# EAGLE design E6_funk (EAGLE 5.07)
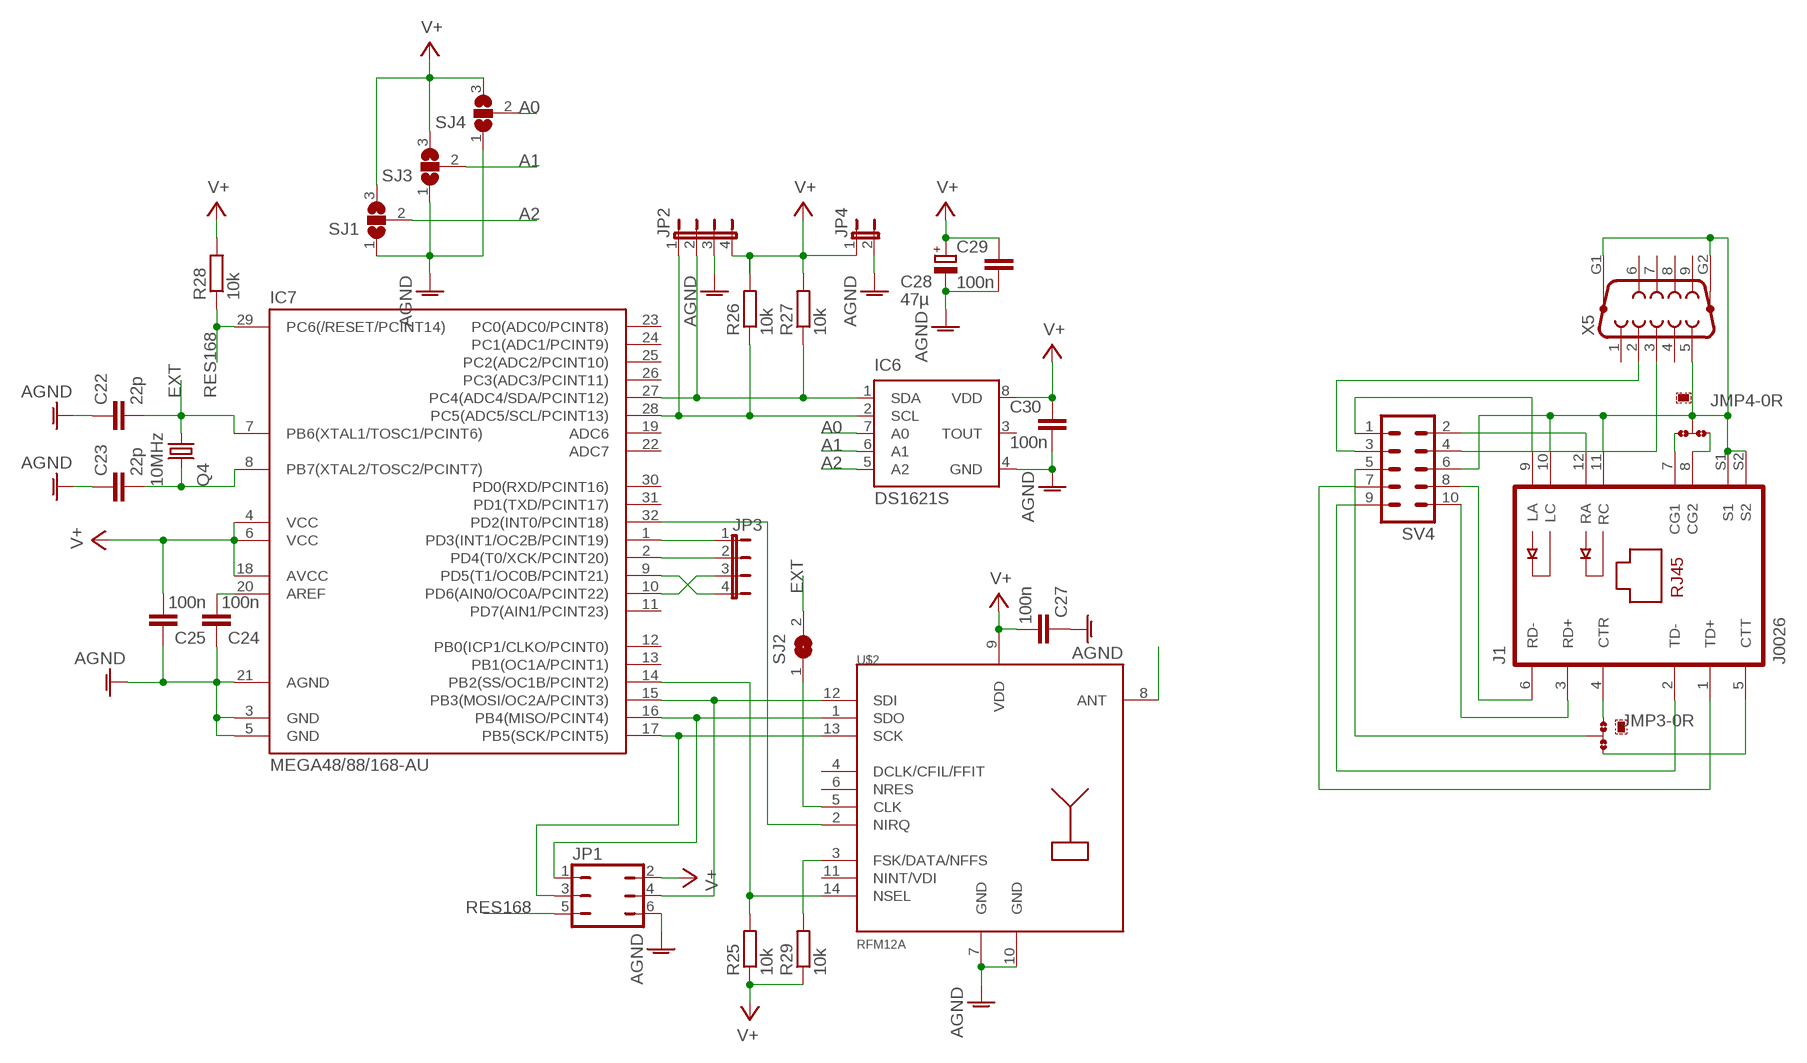
[diagram p0: schematic, sheet 1]

## Parts
C22  22p  C-EUC0805K  [C0805K]
C23  22p  C-EUC0805K  [C0805K]
C24  100n  C-EUC0805K  [C0805K]
C25  100n  C-EUC0805K  [C0805K]
C27  100n  C-EUC0805K  [C0805K]
C28  47µ  CPOL-EUSMCD  [SMC_D]
C29  100n  C-EUC0805K  [C0805K]
C30  100n  C-EUC0805K  [C0805K]
IC6  DS1621S  [SO08]
IC7  MEGA48/88/168-AU  [TQFP32-08]
J1  J0026  [SEGOR]
JMP3  0R-JUMPA  [A0R-JMP]
JMP4  0R-JUMPA  [A0R-JMP]
JP1  JP3Q  [JP3Q]
JP2  JP4E  [JP4]
JP3  JP4E  [JP4]
JP4  JP1E  [JP1]
Q4  10MHz  CRYSTALCTS406  [CTS406]
R25  10k  R-EU_R0805  [R0805]
R26  10k  R-EU_R0805  [R0805]
R27  10k  R-EU_R0805  [R0805]
R28  10k  R-EU_R0805  [R0805]
R29  10k  R-EU_R0805  [R0805]
SJ1  SJ2W  [SJ_2]
SJ2  SJ  [SJ]
SJ3  SJ2W  [SJ_2]
SJ4  SJ2W  [SJ_2]
SV4  ML10  [ML10]
U$2  RFM12A  [RFM1]
X5  F09HP  [F09HP]

## Nets
A0: IC6.7(A0) SJ4.2
A1: IC6.6(A1) SJ3.2
A2: IC6.5(A2) SJ1.2
AGND: C22.1 C23.2 C24.1 C25.1 C27.1 C28.- C29.2 C30.2 IC6.4(GND) IC7.3(GND) IC7.5(GND) IC7.21(AGND) JP1.6 JP2.3 JP4.2 SJ1.1 SJ3.1 SJ4.1 U$2.7(GND) U$2.10(GND)
EXT: C22.2 IC7.7(PB6(XTAL1/TOSC1/PCINT6)) Q4.1 SJ2.2
MASSE: J1.10(LC) J1.11(RC) J1.S1 J1.S2 JMP4.2 SV4.6 X5.5 X5.G1 X5.G2
N$39: J1.7(CG1) JMP4.1
N$40: J1.12(RA) SV4.2
N$41: J1.9(LA) SV4.1
N$42: J1.2(TD-) SV4.9
N$43: J1.1(TD+) SV4.7
N$49: IC7.10(PD6(AIN0/OC0A/PCINT22)) JP3.3
N$56: C23.1 IC7.8(PB7(XTAL2/TOSC2/PCINT7)) Q4.3
N$60: J1.6(RD-) SV4.8
N$61: J1.3(RD+) SV4.10
N$62: J1.8(CG2) JMP4.3
N$63: SV4.3 X5.2
N$64: SV4.4 X5.3
N$65: IC7.17(PB5(SCK/PCINT5)) JP1.3 U$2.13(SCK)
N$66: IC7.16(PB4(MISO/PCINT4)) JP1.1 U$2.1(SDO)
N$67: J1.4(CTR) JMP3.3
N$68: J1.5(CTT) JMP3.1
N$69: JMP3.2 SV4.5
N$70: IC6.1(SDA) IC7.27(PC4(ADC4/SDA/PCINT12)) JP2.2 R27.1
N$71: IC6.2(SCL) IC7.28(PC5(ADC5/SCL/PCINT13)) JP2.1 R26.1
N$72: IC7.15(PB3(MOSI/OC2A/PCINT3)) JP1.4 U$2.12(SDI)
N$73: IC7.14(PB2(SS/OC1B/PCINT2)) R25.2 U$2.14(NSEL)
N$74: IC7.32(PD2(INT0/PCINT18)) U$2.2(NIRQ)
N$75: C24.2 IC7.20(AREF)
N$76: SJ2.1 U$2.5(CLK)
N$77: R29.2 U$2.3(FSK/DATA/NFFS)
N$78: IC7.9(PD5(T1/OC0B/PCINT21)) JP3.4
N$82: IC7.1(PD3(INT1/OC2B/PCINT19)) JP3.1
N$83: IC7.2(PD4(T0/XCK/PCINT20)) JP3.2
N$170: U$2.8(ANT)
RES168: IC7.29(PC6(/RESET/PCINT14)) JP1.5 R28.1
V+: C25.2 C27.2 C28.+ C29.1 C30.1 IC6.8(VDD) IC7.4(VCC) IC7.6(VCC) IC7.18(AVCC) JP1.2 JP2.4 JP4.1 R25.1 R26.2 R27.2 R28.2 R29.1 SJ1.3 SJ3.3 SJ4.3 U$2.9(VDD)
Unconnected: IC6.3(TOUT) IC7.11(PD7(AIN1/PCINT23)) IC7.12(PB0(ICP1/CLKO/PCINT0)) IC7.13(PB1(OC1A/PCINT1)) IC7.19(ADC6) IC7.22(ADC7) IC7.23(PC0(ADC0/PCINT8)) IC7.24(PC1(ADC1/PCINT9)) IC7.25(PC2(ADC2/PCINT10)) IC7.26(PC3(ADC3/PCINT11)) IC7.30(PD0(RXD/PCINT16)) IC7.31(PD1(TXD/PCINT17)) U$2.4(DCLK/CFIL/FFIT) U$2.6(NRES) U$2.11(NINT/VDI) X5.1 X5.4 X5.6 X5.7 X5.8 X5.9

## Library data of the parts
C22-C25 C27 C29 C30 = rcl:C-EU: CAPACITOR, European symbol
C28 = rcl:CPOL-EU: POLARIZED CAPACITOR, European symbol
IC6 = maxim:DS1621: Digital Thermometer and Thermostat Source: http://pdfserv.maxim-ic.com/en/ds/DS1621.pdf
IC7 = avr-4:MEGA48/88/168
J1 = rj45_segor:J0026: RJ45 PulseJack w/LEDs
JMP3 JMP4 = jump-0r-smd:0R-JUMP: SMD 0R 0805 Jumper
JP1 = jumper:JP3Q: JUMPER
JP2 JP3 = jumper:JP4E: JUMPER
JP4 = jumper:JP1E: JUMPER
Q4 = crystal:CRYSTAL: CRYSTAL
R25-R29 = rcl:R-EU_: RESISTOR, European symbol
SJ1 SJ3 SJ4 = jumper:SJ2W: SMD solder JUMPER
SJ2 = jumper:SJ: SMD solder JUMPER
SV4 = con-harting-ml:ML10: HARTING
U$2 = RFMxx:RFM12A
X5 = con-subd:F09HP: SUB-D

## Board
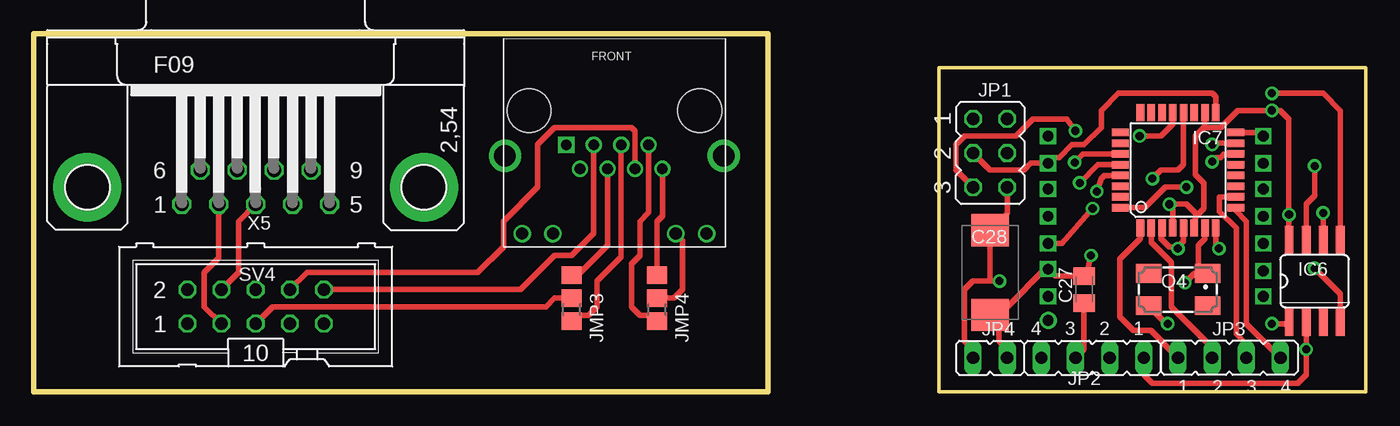
[diagram p1: board, top side]
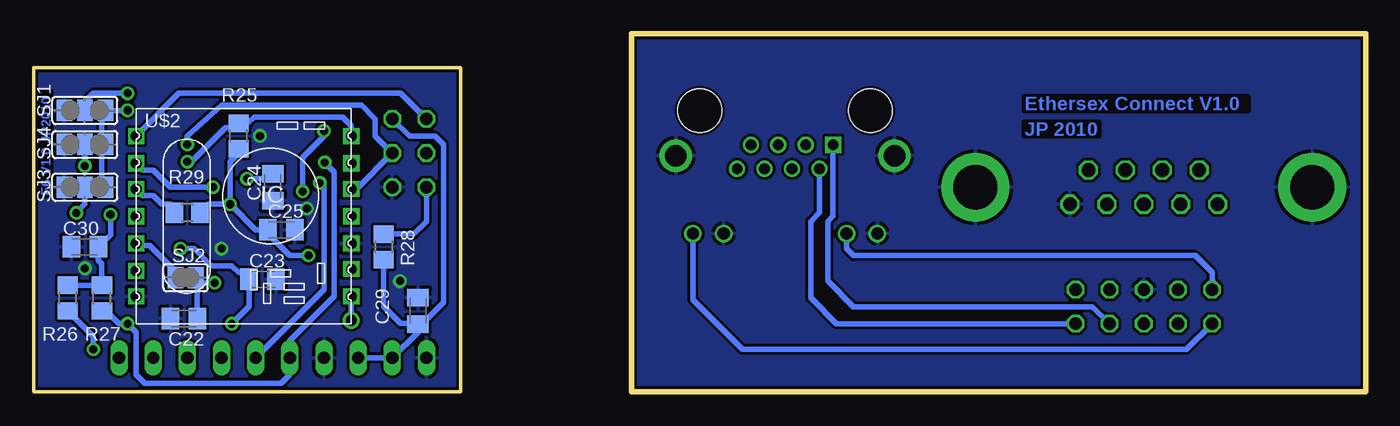
[diagram p2: board, bottom side, seen from below]

Size 99.06 x 26.67 mm. Coordinates in mm from the lower left corner, seen from the top.
Outline: 99.06,24.13 67.31,24.13 67.31,0 99.06,0 99.06,24.13
Outline: 0,0 54.61,0 54.61,26.67 0,26.67 0,0
Copper layers (1*16): Top 0.035mm / dielectric 1.5mm / Bottom 0.035mm
Design rules "ZWILLING": minimum track width 0.2mm, minimum drill 0.5mm, track to track 0.2mm, track to pad 0.2mm, pad to pad 0.15mm, via to via 0.2mm, smd to smd 0mil, copper to edge 0.2mm, drill to drill 0.2mm, minimum pad ring 0.2mm, minimum via ring 0.2mm, stop-mask expansion 0.1mm, vias tented up to drill 0mil, thermal gap 10mil

### Footprints (pad centres in the part's own frame; a part is rotated, then mirrored left to right if it is on the bottom)
C0805K = smd 1.3 x 1.6: 1 -1,0; 2 1,0
SMC_D = smd 2.4 x 2.8: + -3.15,0; - 3.15,0
SO08 = smd 0.66 x 2.032: 1 -1.905,-3.073; 2 -0.635,-3.073; 3 0.635,-3.073; 4 1.905,-3.073; 5 1.905,3.073; 6 0.635,3.073; 7 -0.635,3.073; 8 -1.905,3.073
TQFP32-08 = smd 1.27 x 0.559: 1 -4.293,2.8; 2 -4.293,2; 3 -4.293,1.2; 4 -4.293,0.4; 5 -4.293,-0.4; 6 -4.293,-1.2; 7 -4.293,-2; 8 -4.293,-2.8; 17 4.293,-2.8; 18 4.293,-2; 19 4.293,-1.2; 20 4.293,-0.4; 21 4.293,0.4; 22 4.293,1.2; 23 4.293,2; 24 4.293,2.8 | smd 0.559 x 1.27: 9 -2.8,-4.293; 10 -2,-4.293; 11 -1.2,-4.293; 12 -0.4,-4.293; 13 0.4,-4.293; 14 1.2,-4.293; 15 2,-4.293; 16 2.8,-4.293; 25 2.8,4.293; 26 2,4.293; 27 1.2,4.293; 28 0.4,4.293; 29 -0.4,4.293; 30 -1.2,4.293; 31 -2,4.293; 32 -2.8,4.293
SEGOR = drill 0.8 square: 1 3.57,-0.61 | drill 0.8 round: 2 2.55,1.17; 3 1.53,-0.61; 4 0.51,1.17; 5 -0.51,-0.61; 6 -1.53,1.17; 7 -2.55,-0.61; 8 -3.57,1.17 | drill 0.9 round: 9 -6.86,5.99; 10 -4.57,5.99; 11 6.86,5.99; 12 4.57,5.99 | drill 1.6 pad 2.4 round: S1 -8.13,0.2; S2 8.13,0.2 | hole 3.25: -6.35,-3.15; 6.35,-3.15
A0R-JMP = smd 1.5 x 1.3: 1 0,1.7; 2 0,0; 3 0,-1.7
JP3Q = drill 0.914 octagon: 1 -2.54,-1.27; 2 -2.54,1.27; 3 0,-1.27; 4 0,1.27; 5 2.54,-1.27; 6 2.54,1.27
JP4 = drill 0.914 long: 1 -3.81,0; 2 -1.27,0; 3 1.27,0; 4 3.81,0
JP1 = drill 0.914 long: 1 0,-1.27; 2 0,1.27
CTS406 = smd 1.9 x 1.4: 1 -2.2,-1.2; 2 2.2,-1.2; 3 2.2,1.2; 4 -2.2,1.2
R0805 = smd 1.3 x 1.5: 1 -0.95,0; 2 0.95,0
SJ_2 = smd 1.168 x 1.6: 1 -1.524,0; 2 0,0; 3 1.524,0
SJ = smd 1.168 x 1.6: 1 -0.762,0; 2 0.762,0
ML10 = drill 0.914 octagon: 1 -5.08,-1.27; 2 -5.08,1.27; 3 -2.54,-1.27; 4 -2.54,1.27; 5 0,-1.27; 6 0,1.27; 7 2.54,-1.27; 8 2.54,1.27; 9 5.08,-1.27; 10 5.08,1.27
RFM1 = drill 0.8 square: 1 -7.62,5.08; 2 -7.62,3.048; 3 -7.62,1.143; 4 -7.62,-0.889; 5 -7.62,-2.921; 6 -7.62,-4.953; 7 -7.62,-6.858; 8 8.382,-6.858; 9 8.382,-4.826; 10 8.382,-2.921; 11 8.382,-0.889; 12 8.382,1.143; 13 8.382,3.048; 14 8.382,5.08
F09HP = drill 1.016 octagon: 1 -5.486,-1.27; 2 -2.743,-1.27; 3 0,-1.27; 4 2.743,-1.27; 5 5.486,-1.27; 6 -4.115,1.27; 7 -1.372,1.27; 8 1.372,1.27; 9 4.115,1.27 | drill 3.302 pad 5.08 round: G1 -12.522,0; G2 12.522,0

### Placement (x,y rotation side)
C22  87.88,5.46 0 bottom
C23  82.04,8.38 0 bottom
C24  81.28,15.24 90 bottom
C25  80.64,12.06 180 bottom
C27  78.11,7.62 90 top
C28  71.12,8.89 90 top
C29  70.48,6.03 90 bottom
C30  95.25,10.79 180 bottom
IC6  95.25,8.26 0 top
IC7  85.09,16.51 90 top
J1  43.18,17.78 180 top
JMP3  40.01,6.99 180 top
JMP4  46.35,6.99 180 top
JP1  71.12,17.78 270 top
JP2  78.74,2.54 180 top
JP3  88.9,2.54 0 top
JP4  71.12,2.54 90 top
Q4  85.09,7.62 180 top
R25  83.82,19.05 90 bottom
R26  96.52,6.99 90 bottom
R27  93.98,6.99 90 bottom
R28  73.03,10.79 270 bottom
R29  87.63,13.34 180 bottom
SJ1  95.25,20.95 0 bottom
SJ2  87.76,8.51 0 bottom
SJ3  95.25,15.24 0 bottom
SJ4  95.25,18.41 0 bottom
SV4  16.51,6.35 0 top
U$2  83.82,13.97 0 bottom
X5  16.51,15.24 0 top

### Tracks (layer width: path | path; a pad name or v marks a point on that pad's centre or on a via)
A0  (via drill 0.6)
  Top 0.406: v95.25,16.83 95.25,14.61 94.61,13.97 IC6.7
  Bottom 0.406: v95.25,16.83 SJ4.2
A1  (via drill 0.6)
  Top 0.406: IC6.6 v95.89,13.34
  Bottom 0.406: SJ3.2 95.25,13.97 v95.89,13.34
A2  (via drill 0.6)
  Top 0.406: IC6.5 97.16,20.95 95.89,22.23 v92.08,22.23
  Bottom 0.406: SJ1.2 95.25,21.59 94.61,22.23 v92.08,22.23
AGND  (via drill 0.6)
  Top 0.406: IC7.3 83.89,11.5 83.82,11.43 84.45,10.79 85.09,10.79 | IC7.5 85.49,11.2 85.09,10.79 | IC7.21 84.69,19.92 83.82,19.05 v82.23,19.05 | 71.12,8.26 69.85,8.26 69.22,7.62 69.22,3.81 69.85,3.17 JP4.2 | 71.12,8.26 v71.82,8.26 | JP1.6 72.39,13.31 C28.- 71.12,8.26 | U$2.10 76.45,11.05 v78.74,13.65 | C27.1 78.11,3.17 JP2.3 | 85.09,10.79 v85.09,10.67 | IC6.4 97.16,7.3 v95.25,9.21
  pour Bottom: 99.06,24.13 67.31,24.13 67.31,0 99.06,0
EXT  (via drill 0.6)
  Top 0.406: IC7.7 87.09,11.4 86.61,10.92 86.61,9.4 86.71,9.4 Q4.1 86.29,8.82 v85.6,8.13
  Bottom 0.406: C22.2 86.88,7.62 | 86.88,7.62 86.88,8.4 SJ2.2 | v85.6,8.13 86.38,8.13 86.88,7.62
MASSE
  Top 0.406: JMP4.2 47.62,6.99 48.26,7.62 48.26,11.28 J1.10
  pour Bottom: 0,0 54.61,0 54.61,26.67 0,26.67
N$39
  Top 0.406: JMP4.1 45.92,5.71 45.09,5.71 44.45,6.35 44.45,9.53 45.09,10.16 45.09,12.7 45.73,13.35 J1.7
N$40
  Bottom 0.406: J1.12 38.61,10.67 38.1,10.16 12.7,10.16 11.43,8.89 SV4.2
N$41
  Bottom 0.406: J1.9 50.04,6.86 46.35,3.17 13.34,3.17 SV4.1
N$42
  Bottom 0.406: SV4.9 39.37,5.08 41.27,6.99 41.27,12.7 40.63,13.35 J1.2
N$43
  Bottom 0.406: SV4.7 20.32,6.35 38.1,6.35 40.01,8.26 40.01,12.7 39.61,13.1 J1.1
N$49
  Top 0.406: IC7.10 88.17,14.51 88.17,13.43 89.41,12.19 89.41,4.32 90.17,3.56 JP3.3
N$56  (via drill 0.6)
  Top 0.406: IC7.8 87.89,10.92 v88.14,10.67 | v84.33,5.08 84.23,5.08 Q4.3
  Bottom 0.406: v88.14,10.67 87.12,10.67 85.85,9.4 84.33,9.4 83.82,8.89 83.55,8.89 C23.1 83.04,6.37 v84.33,5.08
N$60
  Top 0.406: SV4.8 20.32,8.89 33.02,8.89 34.92,10.79 34.92,12.7 37.47,15.24 37.47,18.41 38.73,19.68 44.45,19.68 44.71,19.43 J1.6
N$61
  Top 0.406: J1.3 41.65,11.8 40.01,10.16 38.73,10.16 36.2,7.62 SV4.10
N$62
  Top 0.406: J1.8 46.75,13.1 46.35,12.7 JMP4.3
N$63
  Top 0.406: X5.2 13.77,9.96 12.7,8.89 12.7,6.35 SV4.3
N$64
  Top 0.406: X5.3 15.24,12.7 15.24,8.89 SV4.4
N$65
  Top 0.406: JP1.3 71.12,16.51 73.66,16.51 74.17,17.02 U$2.13 75.88,17.46 76.26,17.46 77.22,18.41 78.11,18.41 79.38,19.68 79.38,20.95 80.64,22.23 87.63,22.23 87.89,21.96 IC7.17
N$66
  Top 0.406: IC7.16 91.18,19.31 U$2.1
  Bottom 0.406: JP1.1 71.75,22.23 88.27,22.23 U$2.1
N$67
  Top 0.406: JMP3.3 40.44,8.69 42.67,10.92 J1.4
N$68
  Top 0.406: J1.5 43.69,10.04 41.91,8.26 41.91,6.35 41.27,5.71 40.44,5.71 JMP3.1
N$69
  Top 0.406: JMP3.2 38.73,6.99 38.1,6.35 17.78,6.35 SV4.5
N$70  (via drill 0.6)
  Top 0.406: IC7.27 78.03,17.71 v77.41,17.08 | v92.08,5.08 93.24,5.08 IC6.1
  Bottom 0.406: 80.01,3.81 JP2.2 | R27.1 93.67,6.04 92.71,5.08 v92.08,5.08 91.44,4.45 91.44,1.27 90.81,0.64 80.64,0.64 80.01,1.27 80.01,3.81 | 80.01,3.81 76.71,7.11 76.71,16.38 v77.41,17.08
N$71  (via drill 0.6)
  Top 0.406: IC7.28 79.14,16.91 v77.79,15.56 | IC6.2 v94.61,3.17 94.61,1.27 93.98,0.64 83.19,0.64 82.55,1.27 JP2.1
  Bottom 0.406: v94.61,3.17 94.61,4.13 R26.1 | v77.79,15.56 77.47,15.24 77.47,7.62 JP2.1
N$72  (via drill 0.6)
  Top 0.406: IC7.15 87.72,18.51 v87.63,18.41
  Bottom 0.406: U$2.12 75.06,15.11 JP1.4 73.66,19.05 73.66,20.32 74.68,21.34 85.09,21.34 87.63,19.05 v87.63,18.41
N$73  (via drill 0.6)
  Top 0.406: IC7.14 88.51,17.71 88.27,17.46 87.95,17.46 v87.63,17.14
  Bottom 0.406: R25.2 83.5,20 | v87.63,17.14 87.31,17.14 84.77,19.68 84.14,19.68 R25.2 | U$2.14 75.44,19.81 76.07,20.45 82.68,20.45 83.06,20.07 83.75,20.07 R25.2
N$74  (via drill 0.6)
  Top 0.406: v85.72,15.24 84.14,15.24 82.61,13.71 IC7.32
  Bottom 0.406: U$2.2 90.93,16.51 90.17,16.51 88.9,15.24 v85.72,15.24
N$75  (via drill 0.6)
  Top 0.406: IC7.20 85.49,16.91 85.09,16.51 83.82,16.51 v83.19,15.88
  Bottom 0.406: C24.2 81.64,15.88 v83.19,15.88
N$76
  Bottom 0.406: SJ2.1 88.52,9.02 90.42,10.92 91.31,10.92 U$2.5
N$77
  Bottom 0.406: R29.2 88.58,13.65 88.9,13.97 89.53,13.97 90.17,14.61 90.93,14.61 U$2.3
N$78
  Top 0.406: IC7.9 89.38,13.49 90.17,12.7 90.17,5.08 JP3.4
N$82
  Top 0.406: IC7.1 82.29,11.43 81.28,10.42 81.28,10.41 80.77,9.91 80.77,5.59 81.79,4.57 83.06,4.57 JP3.1
N$83
  Top 0.406: JP3.2 87.63,3.3 84.58,6.35 84.58,9.65 83.09,11.14 IC7.2
N$171  (via drill 0.8 pad 1.27)
  Bottom 0.406: v75.44,5.33 75.44,7.11
RES168  (via drill 0.6)
  Top 0.406: IC7.29 79.61,16.11 79.38,15.88 v79.06,14.92 | JP1.5 68.58,16.51 68.58,18.41 69.22,19.05 73.03,19.05 74.3,20.32 76.83,20.32 v77.47,19.43
  Bottom 0.406: v77.47,19.43 77.47,19.05 79.06,17.46 v79.06,14.92 | R28.1 70.81,11.74 69.85,12.7 JP1.5
V+  (via drill 0.6)
  Top 0.406: C28.+ 71.14,5.71 | JP4.1 72.39,3.17 71.75,3.81 71.75,5.11 C28.+ | C28.+ 71.73,6.35 72.39,6.35 75.18,9.14 U$2.9 75.96,8.62 C27.2 78.38,8.89 78.38,9.16 v78.61,10.16 | IC6.8 v93.34,13.21 93.34,20.32 92.71,20.95 91.44,20.95 | IC7.4 84.69,13.73 v84.45,13.97 85.72,13.97 86.52,13.18 | 87.09,19.68 IC7.18 | IC7.6 86.36,12.29 86.36,13.02 86.52,13.18 | 87.09,19.68 88.27,19.68 89.53,20.95 91.44,20.95 | 87.09,19.68 87,19.68 86.36,19.05 86.36,16.19 87,15.56 87,13.65 R29.1 86.52,13.18 | 91.44,20.95 v92.08,20.95
  Bottom 0.406: C29.1 70.48,4.45 JP4.1 JP2.4 | R28.2 73.03,6.38 71.75,5.11 70.88,5.11 C29.1 | JP1.2 71.12,19.05 69.22,19.05 68.58,18.41 68.58,6.67 70.22,5.03 C29.1 | SJ3.3 93.98,15.49 93.98,18.41 SJ4.3 93.98,18.67 93.98,20.95 SJ1.3 v92.08,20.95 | R26.2 R27.2 93.98,9.53 94.25,9.79 C30.1 93.34,11.7 v93.34,13.21 | v84.45,13.97 82.55,12.06 C25.2 81.28,11.7 81.28,11.43 80.01,10.16 v78.61,10.16 | R25.1 83.82,17.78 84.45,17.14 v84.45,13.97 | v84.45,13.97 86.05,13.97 R29.1

### Text on the board
Bottom: Ethersex Connect V1.0 | JP 2010 | E6 V1.0 JP2010
tValues: GND | +3...5V | +3...5V | GND | I2C SDA | I2C SCL | PD3 | PD4 | PD6 | PD5